# Altium schematic sheet Integrator_Differentiator.SchDoc
size 431 x 279 mm; SheetNumber: 3; SheetTotal: 3
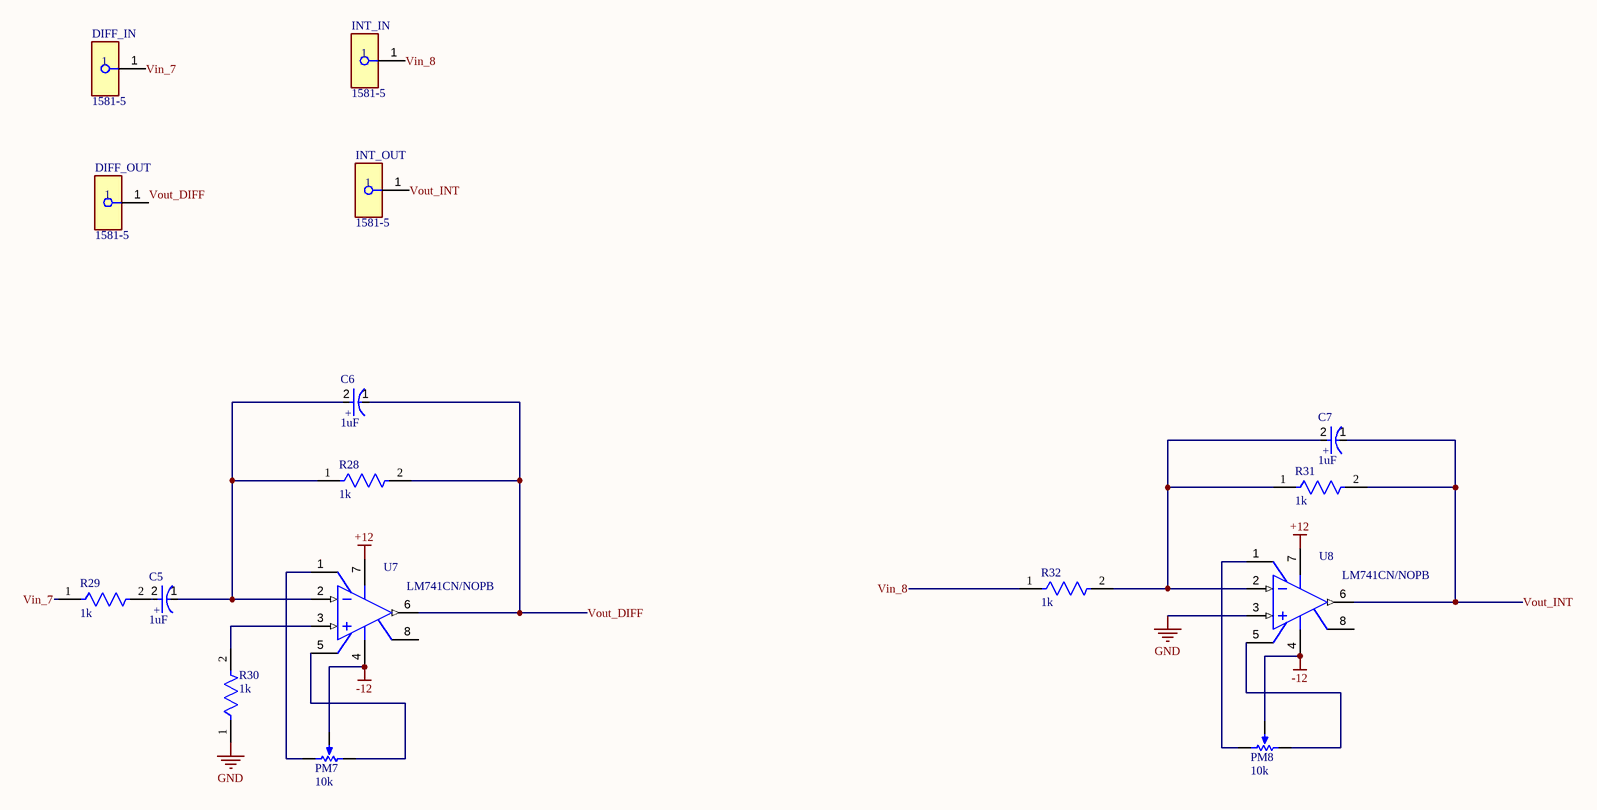
[diagram p0: Integrator_Differentiator.SchDoc]

## Parts
C5  1uF  [FP-ECA-2CHG010I-MFG]
C6  1uF  [FP-ECA-2CHG010I-MFG]
C7  1uF  [FP-ECA-2CHG010I-MFG]
DIFF_IN  1581-5  [FP-1581-5-MFG]
DIFF_OUT  1581-5  [FP-1581-5-MFG]
INT_IN  1581-5  [FP-1581-5-MFG]
INT_OUT  1581-5  [FP-1581-5-MFG]
PM7  10k  [BOUR-3362P]
PM8  10k  [BOUR-3362P]
R28  1k  [FP-RLR07-MFG]
R29  1k  [FP-RLR07-MFG]
R30  1k  [FP-RLR07-MFG]
R31  1k  [FP-RLR07-MFG]
R32  1k  [FP-RLR07-MFG]
U7  LM741CN/NOPB  [P0008A]
U8  LM741CN/NOPB  [P0008A]

## Nets
+12: U7.7(V+) U8.7(V+)
-12: PM7.2(S) PM8.2(S) U7.4(V-) U8.4(V-)
GND: R30.1 U8.3(IN+)
Vin_7: DIFF_IN.1 R29.1
Vin_8: INT_IN.1 R32.1
Vout_DIFF: C6.1(C) DIFF_OUT.1 R28.2 U7.6(OUT)
Vout_INT: C7.1(C) INT_OUT.1 R31.2 U8.6(OUT)
NetC5_1: C5.1(C) C6.2(A) R28.1 U7.2(IN-)
NetC5_2: C5.2(A) R29.2
NetC7_2: C7.2(A) R31.1 R32.2 U8.2(IN-)
NetPM7_1: PM7.1(CCW) U7.5(OFS_NULL)
NetPM7_3: PM7.3(CW) U7.1(OFS_NULL)
NetPM8_1: PM8.1(CCW) U8.5(OFS_NULL)
NetPM8_3: PM8.3(CW) U8.1(OFS_NULL)
NetR30_2: R30.2 U7.3(IN+)

Not connected (* = marked no-connect by the designer): U7 8(NC); U8 8(NC)

## Notes on the sheet
- DWG. NO.
- REV.
- SHT.
- THIS DOCUMENT AND THE DATA DISCLOSED HEREIN OR HEREWITH IS THE PROPERTY OF ALTIUM LIMITED AND MAY BE FREELY DISTRIBUTED IN WHOLE. NO RIGHTS ARE RESERVED OR EXPRESS OR IMPLIED WARANTEE GIVEN.
- REVISION
- DESCRIPTION
- DATE
- APPROVED
- ENG:
- APPROVALS
- PROJECT
- DSN:
- CHK:
- REFERENCE DOCUMENTS
- PROJECT REVISION:
- TITLE
- DOCUMENT REVISION:
- DESIGN ITEM:
- BOM:
- FAB DWG:
- PCB DWG:
- ASSY DWG:
- SCALE:
- SIZE
- B
- CAGE CODE
- FILE NAME
- DWG NO.
- SHEET
- OF
- REV
- (in symbol CMP-05427-002176-1) +

## Library data of the parts
C5-C7 = CMP-05427-002176-1: CAP ALUM 1UF 20% 160V RADIAL; Lead/Base Style: Straight; Ripple Current: 17mA; Life (Hours): 2000Hour; Voltage Rating (DC): 160V; Max Operating Temperature: 105°C; Radiation Hardening: No; Min Operating Temperature: -25°C; Packaging: Ammo Pack; Series: NHG; Capacitance: 1uF; Height - Seated (Max): 0.48inch; Lead Pitch: 2.5mm; Diameter: 6.3mm; Length: 11.2mm; Package Quantity: 2000; Termination: Radial; RoHS Compliant: Yes; Voltage Rating: 160V; Tolerance: 20%; Height: 11.2mm; Case/Package: Radial; Mount: Through Hole
DIFF_IN DIFF_OUT INT_IN INT_OUT = CMP-73906-000011-1: CONN BANANA JACK TURRET GREEN; Body Material: PC; Number of Contacts: 1; Max Current Rating: 15A; Voltage Rating (AC): 30V; Insulation: Mating End Insulated; Voltage Rating: 2.5kV; Voltage Rating (DC): 60V; Gender: Female; Height: 0.25inch; Mount: Panel; RoHS Compliant: Yes; Length: 1.22inch; Orientation: Straight; Diameter: 4.22mm; Lead Free: Lead Free; Package Quantity: 1; Termination: Turret; Current Rating: 15A; Packaging: Bag; Series: 1581; REACH SVHC: No SVHC; Number of Positions: 1; Contact Plating: Tin; Housing Color: Green; Contact Material: Brass; Insulation Material: Polycarbonate; Weight: 0.126lb; Number of Ports: 1; Color: Green; Housing Material: Polycarbonate; Width: 4inch
PM7 PM8 = CMP-1747-00004-1: Square Trimpot(R) Trimming Potentiometer, 10 KOhm, 300 V, -55 to 125 degC, 3-Pin THD, RoHS, Tube; Voltage Rating: 220 mV; Power Rating: 1 W; Tolerance: 1%; Resistance: 50 mohm; Case/Package: 1206; Length: 3.2 mm; RoHSCompliant: True; PackageDescription: 3-Pin Through Hole Device, Body 6.6 x 6.99 mm, Pitch 2.54 mm; ComponentLink2Description: Datasheet; REACH SVHC: No SVHC; Mount: Surface Mount; Height: 0.6 mm; Packaging: Tape and Reel; ComponentLink1URL: http://www.bourns.com/; Case Code (Imperial): 0612; Pins: 2; Case Code (Metric): 1632; ComponentLink2URL: http://www.bourns.com/docs/Product-Datasheets/3362.pdf; Min Operating Temperature: -25degC; ComponentLink1Description: Manufacturer URL; PackageReference: 3326P; Max Operating Temperature: 125degC; Width: 1.6 mm; Package Quantity: 5000; DatasheetVersion: May-16
R28-R32 = CMP-00030-39447724-1: RLR07C1001FSB14 Fixed Resistor, Metal Film, 0.25W, 1000ohm, 250V, 1% +/-Tol, 100ppm/Cel, Through Hole Mount; Wire/Cable Diameter: 50.8µm; Lead Diameter: 640µm; Max Power Dissipation: 250mW; Temperature Coefficient: 100ppm/°C; Resistance: 1kΩ; Lead Length: 38.1mm; Value: 1kΩ; Voltage Rating: 250V; Lead Free: Contains Lead; REACH SVHC: Unknown; Packaging: Bulk; Military Standard: MIL-PRF-39017; Width: 2.29mm; Max Operating Temperature: 150°C; Length: 7.62mm; Min Operating Temperature: -65°C; Composition: Metal Film; Diameter: 2.29mm; Radiation Hardening: No; Features: Military, Moisture Resistant, Weldable; Failure Rate: 0.001%; Case/Package: Conformal; Tolerance: 1%; Voltage Rating (DC): 250V; Schedule B: 8533210090, 8533210090; RoHS: Non-Compliant; Termination: Axial; Power Rating: 250mW; Contact Plating: Lead, Tin; NexarPartId: 39447724; Number of Terminations: 2; Number of Pins: 14
U7 U8 = CMP-0055-00162-3: Operational Amplifier, 8-pin MDIP, Pb-Free; Manufacturer: Texas Instruments; PackageTopMarking: NSUZXYTTE#*LM*741CN; PowerWise: N; CompType: Amplifiers; ComponentLink1Description: Datasheet URL; ComponentLink1URL: http://www.ti.com/general/docs/lit/getliterature.tsp?genericPartNumber=LM741&fileType=pdf; PackageDescription: MDIP, .365 x .250 x .130in, 8 Lead, .100in Pitch; RoHS: Y; PinCount: 8; Code_JEDEC: MS-001-BA; Package Reference: P0008A